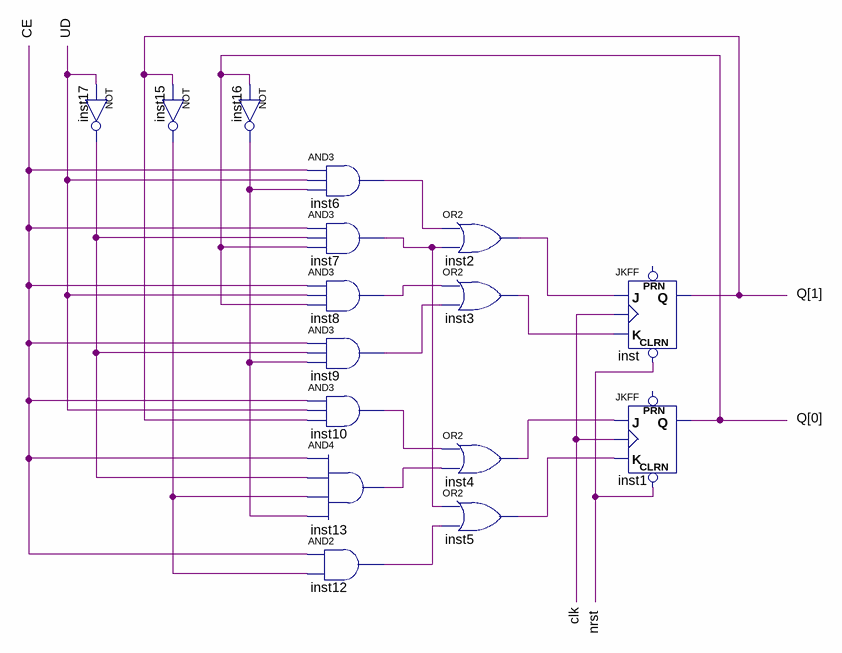
[diagram p0: schematic sheet]
// Quartus schematic T9-gray.bdf as structural Verilog: 16 symbols, 0 pins
module \T9-gray  (
);

  wire CE, clk, inst2_out, inst3_out, inst4_out, inst5_out, inst6_out, inst7_out, inst8_out, inst9_out,
       inst10_out, inst12_out, inst13_out, inst15_out, inst16_out, inst17_out, nrst, UD;
  wire [1:0] Q;

  not inst17 (inst17_out, UD);
  not inst15 (inst15_out, Q[1]);
  not inst16 (inst16_out, Q[0]);
  and inst6 (inst6_out, CE, UD, inst16_out);
  and inst7 (inst7_out, CE, inst17_out, Q[0]);
  and inst8 (inst8_out, CE, UD, Q[0]);
  and inst9 (inst9_out, CE, inst17_out, inst16_out);
  and inst10 (inst10_out, CE, UD, Q[1]);
  and inst13 (inst13_out, CE, inst17_out, inst15_out, inst16_out);
  and inst12 (inst12_out, CE, inst15_out);
  or inst2 (inst2_out, inst6_out, inst7_out);
  or inst3 (inst3_out, inst8_out, inst9_out);
  or inst4 (inst4_out, inst10_out, inst13_out);
  or inst5 (inst5_out, inst7_out, inst12_out);
  JKFF inst (.CLRN(nrst), .K(inst3_out), .J(inst2_out), .CLK(clk), .Q(Q[1]));  // open: PRN
  JKFF inst1 (.CLRN(nrst), .K(inst5_out), .J(inst4_out), .CLK(clk), .Q(Q[0]));  // open: PRN
endmodule
